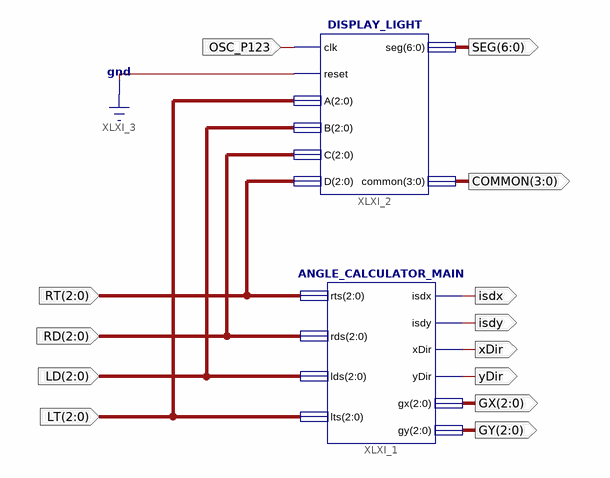
[diagram p0: schematic sheet 1]
// Xilinx ISE schematic main_input_processor.sch (spartan6) as structural Verilog: 2 symbols, 13 ports
module main_input_processor (
  input  OSC_P123,
  input  [2:0] RT,
  input  [2:0] RD,
  input  [2:0] LD,
  input  [2:0] LT,
  output isdx,
  output isdy,
  output xDir,
  output yDir,
  output [2:0] GX,
  output [2:0] GY,
  output [6:0] SEG,
  output [3:0] COMMON
);

  ANGLE_CALCULATOR_MAIN XLXI_1 (
    .rts(RT), .rds(RD), .lds(LD), .lts(LT), .isdx(isdx), .isdy(isdy), .xDir(xDir), .yDir(yDir), .gx(GX),
    .gy(GY));
  DISPLAY_LIGHT XLXI_2 (.clk(OSC_P123), .reset(1'b0), .A(LT), .B(LD), .C(RD), .D(RT), .seg(SEG), .common(COMMON));
endmodule
